# Altium schematic sheet SimpleNode3.SchDoc
size A4
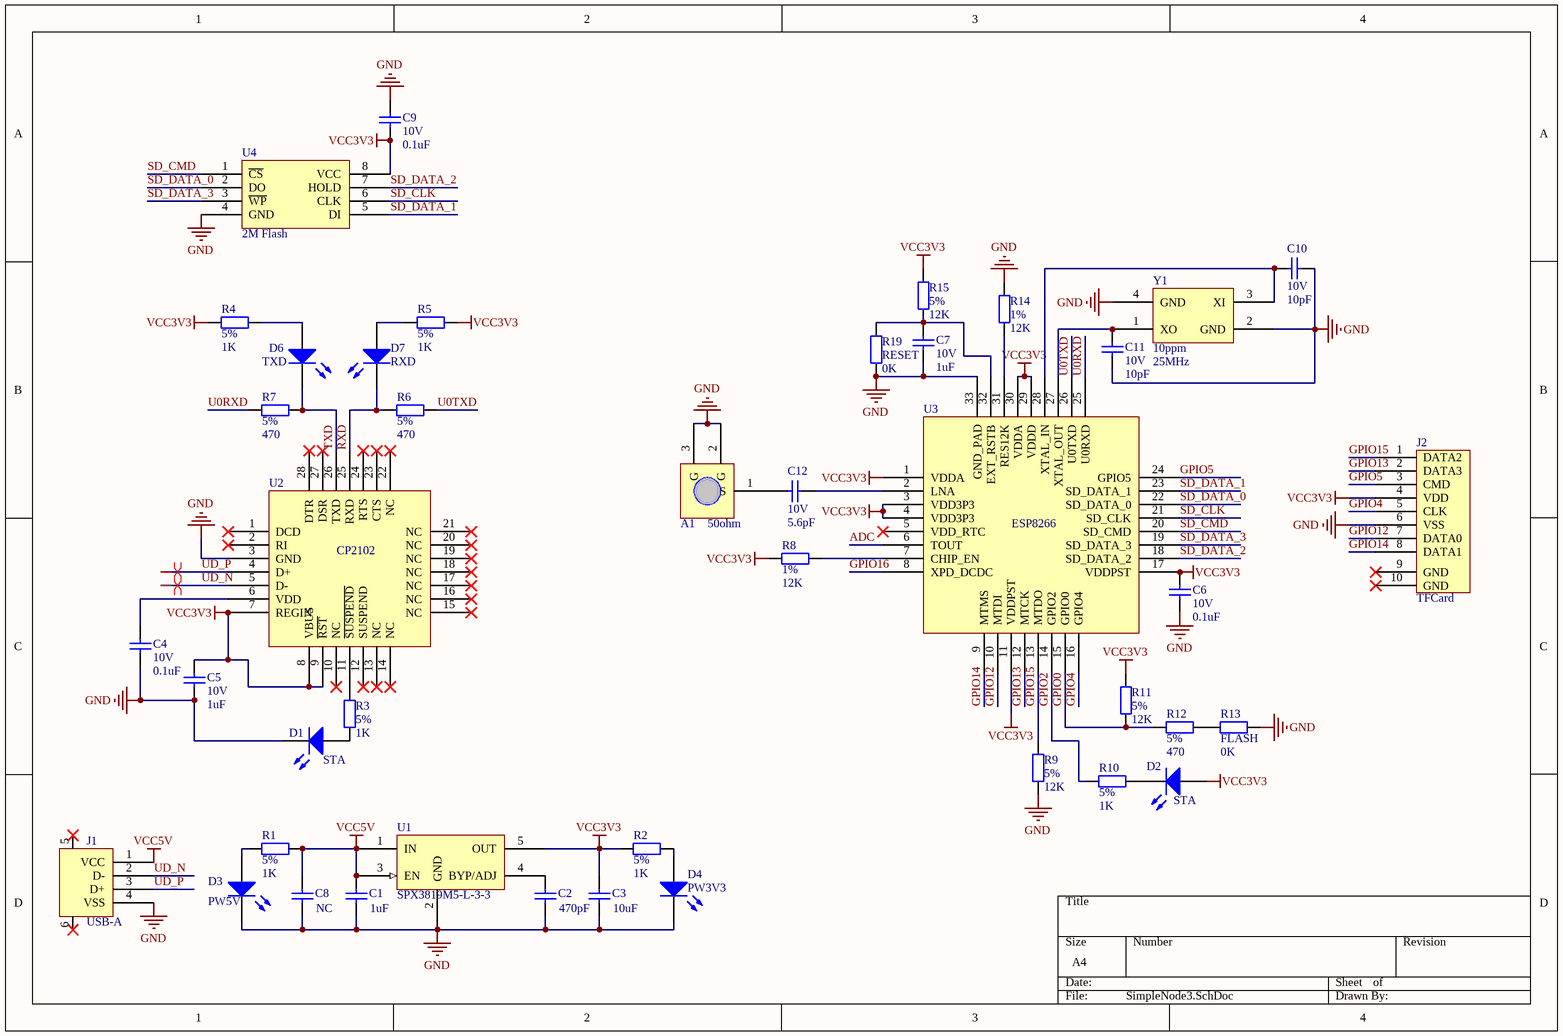
[diagram p0: SimpleNode3.SchDoc]

## Parts
A1  50ohm  [IPEX-1 底座]
C1  value 1uF  [C0402]  (hidden comment: 105)
C2  value 470pF  [C0402]  (hidden comment: CAP)
C3  value 10uF  [C0402]  (hidden comment: CAP)
C4  10V  value 0.1uF  [C0402]
C5  10V  value 1uF  [C0402]
C6  10V  value 0.1uF  [C0402]
C7  10V  value 1uF  [C0402]
C8  value NC  [C0402]  (hidden comment: CAP)
C9  10V  value 0.1uF  [C0402]
C10  10V  value 10pF  [C0402]
C11  10V  value 10pF  [C0402]
C12  10V  value 5.6pF  [C0402]
D1  STA  [LED0402]
D2  STA  [LED0402]
D3  PW5V  [LED0402]
D4  PW3V3  [LED0402]
D6  TXD  [LED0402]
D7  RXD  [LED0402]
J1  USB-A  [USB-A 公头]
J2  TFCard  [TFCard 卡座 简易]
R1  5%  value 1K  [R0402]
R2  5%  value 1K  [R0402]
R3  5%  value 1K  [R0402]
R4  5%  value 1K  [R0402]
R5  5%  value 1K  [R0402]
R6  5%  value 470  [R0402]
R7  5%  value 470  [R0402]
R8  1%  value 12K  [R0402]
R9  5%  value 12K  [R0402]
R10  5%  value 1K  [R0402]
R11  5%  value 12K  [R0402]
R12  5%  value 470  [R0402]
R13  FLASH  value 0K  [R0402]
R14  1%  value 12K  [R0402]
R15  5%  value 12K  [R0402]
R19  RESET  value 0K  [R0402]
U1  SPX3819M5-L-3-3  [SOT25-5]
U2  CP2102  [MLP28]
U3  ESP8266  [QFN32L]
U4  2M Flash  [SOIC8]
Y1  10ppm  value 25MHz  [XTAL-2520]

## Nets
GND: A1.2(G) A1.3(G) C1.1 C2.1 C3.1 C4.1 C5.1 C6.1 C7.1 C8.1 C9.1 C10.2 C11.2 D1.2(K) D3.2(K) D4.2(K) J1.4(VSS) J2.6(VSS) R9.1 R13.1 R14.2 R19.1 U1.2(GND) U2.3(GND) U3.33(GND_PAD) U4.4(GND) Y1.2(GND) Y1.4(GND)
VCC3V3: C3.2 C5.2 C6.2 C9.2 D2.1(A) J2.4(VDD) R2.2 R4.1 R5.2 R8.1 R11.2 R15.2 U1.5(OUT) U2.7(REGIN) U2.8(VBUS) U2.9(~{RST}) U3.1(VDDA) U3.3(VDD3P3) U3.4(VDD3P3) U3.11(VDDPST) U3.17(VDDPST) U3.29(VDDD) U3.30(VDDA) U4.8(VCC)
VCC5V: C1.2 C8.2 J1.1(VCC) R1.1 U1.1(IN) U1.3(EN)
ADC: U3.6(TOUT)
GPIO0: R11.1 R12.1 U3.15(GPIO0)
GPIO2: R10.2 U3.14(GPIO2)
GPIO4: J2.5(CLK) U3.16(GPIO4)
GPIO5: J2.3(CMD) U3.24(GPIO5)
GPIO12: J2.7(DATA0) U3.10(MTDI)
GPIO13: J2.2(DATA3) U3.12(MTCK)
GPIO14: J2.8(DATA1) U3.9(MTMS)
GPIO15: J2.1(DATA2) R9.2 U3.13(MTDO)
GPIO16: U3.8(XPD_DCDC)
RXD: D7.2(K) R6.2 U2.25(RXD)
SD_CLK: U3.21(SD_CLK) U4.6(CLK)
SD_CMD: U3.20(SD_CMD) U4.1(~{CS})
SD_DATA_0: U3.22(SD_DATA_0) U4.2(DO)
SD_DATA_1: U3.23(SD_DATA_1) U4.5(DI)
SD_DATA_2: U3.18(SD_DATA_2) U4.7(HOLD)
SD_DATA_3: U3.19(SD_DATA_3) U4.3(~{WP})
TXD: D6.2(K) R7.1 U2.26(TXD)
U0RXD: R7.2 U3.25(U0RXD)
U0TXD: R6.1 U3.26(U0TXD)
UD_N: J1.2(D-) U2.5(D-)
UD_P: J1.3(D+) U2.4(D+)
NetA1_1: A1.1(S) C12.1
NetC2_2: C2.2 U1.4(BYP/ADJ)
NetC4_2: C4.2 U2.6(VDD)
NetC7_2: C7.2 R15.1 R19.2 U3.32(EXT_RSTB)
NetC10_1: C10.1 U3.28(XTAL_IN) Y1.3(XI)
NetC11_1: C11.1 U3.27(XTAL_OUT) Y1.1(XO)
NetC12_2: C12.2 U3.2(LNA)
NetD1_1: D1.1(A) R3.1
NetD2_2: D2.2(K) R10.1
NetD3_1: D3.1(A) R1.2
NetD4_1: D4.1(A) R2.1
NetD6_1: D6.1(A) R4.2
NetD7_1: D7.1(A) R5.1
NetR3_2: R3.2 U2.11(~{SUSPEND})
NetR8_2: R8.2 U3.7(CHIP_EN)
NetR12_2: R12.2 R13.2
NetR14_1: R14.1 U3.31(RES12K)

Not connected (* = marked no-connect by the designer): J1 5* 6*; J2 9(GND)* 10(GND)*; U2 1(DCD)* 2(RI)* 10(NC)* 12(SUSPEND)* 13(NC)* 14(NC)* 15(NC)* 16(NC)* 17(NC)* 18(NC)* 19(NC)* 20(NC)* 21(NC)* 22(NC)* 23(CTS)* 24(RTS)* 27(DSR)* 28(DTR)*; U3 5(VDD_RTC)*

## Layout directives
differential pair: UD_N, UD_P

## Library data of the parts
A1 = IPEX-1 底座
C1-C12 = 贴片无极性电容
D1-D4 D6 D7 = 贴片发光二级管
J1 = USB-A 公头
J2 = TFCard 卡座 简易
R1-R15 R19 = 贴片电阻
U1 = SPX3819M5-L-3-3: 贴片5V转3.3V芯片
U2 = CP2102: 贴片USB转TTL
U3 = ESP8266: ESP8266无线WiFi芯片
U4 = GD25Q16CSIG: 贴片2M存储Flash芯片
Y1 = 贴片无源晶振